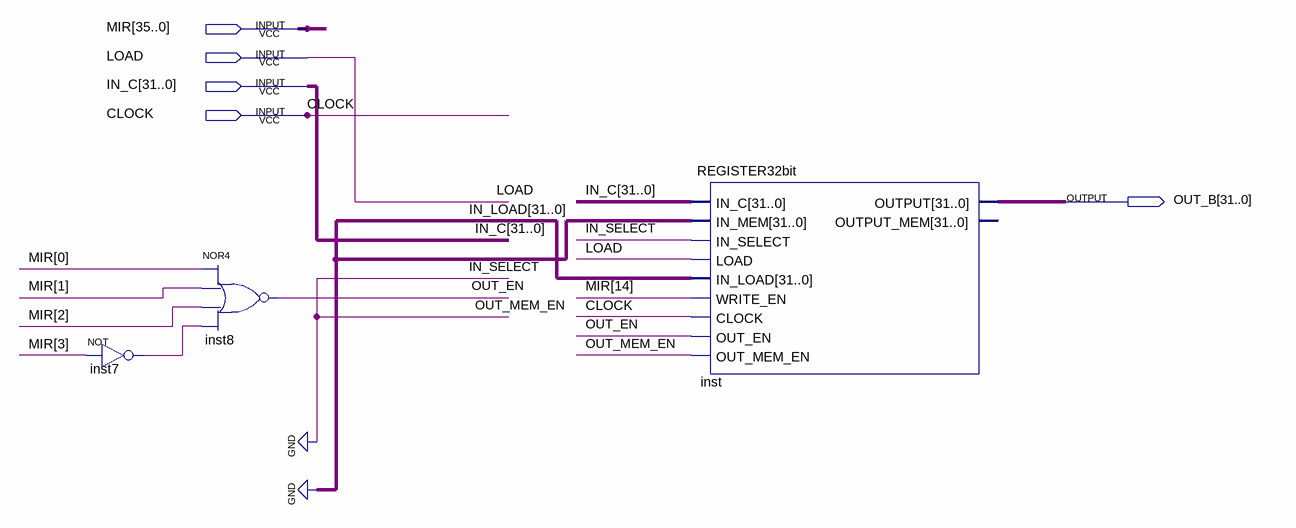
[diagram p0: schematic sheet]
// Quartus schematic OPC.bdf as structural Verilog: 3 symbols, 5 pins
module OPC (
  input  [35:0] MIR,
  input  LOAD,
  input  [31:0] IN_C,
  input  CLOCK,
  output [31:0] OUT_B
);

  wire inst7_out, OUT_EN;

  not inst7 (inst7_out, MIR[3]);
  nor inst8 (OUT_EN, MIR[0], MIR[1], MIR[2], inst7_out);
  REGISTER32bit inst (
    .IN_C(IN_C), .IN_MEM({32{1'b0}}), .IN_SELECT(1'b0), .LOAD(LOAD), .IN_LOAD({32{1'b0}}),
    .WRITE_EN(MIR[14]), .CLOCK(CLOCK), .OUT_EN(OUT_EN), .OUT_MEM_EN(1'b0), .OUTPUT(OUT_B));  // open: OUTPUT_MEM
endmodule
